# EAGLE design Hirose64-PlatingInterface (EAGLE 9.6.2)
DESIGNER: JON NEWMAN, JAKOB VOIGTS; DESIGN_NAME: HEADSTAGE-64; LICENSE: CERN OHL v1.2; REVISION: 1.2
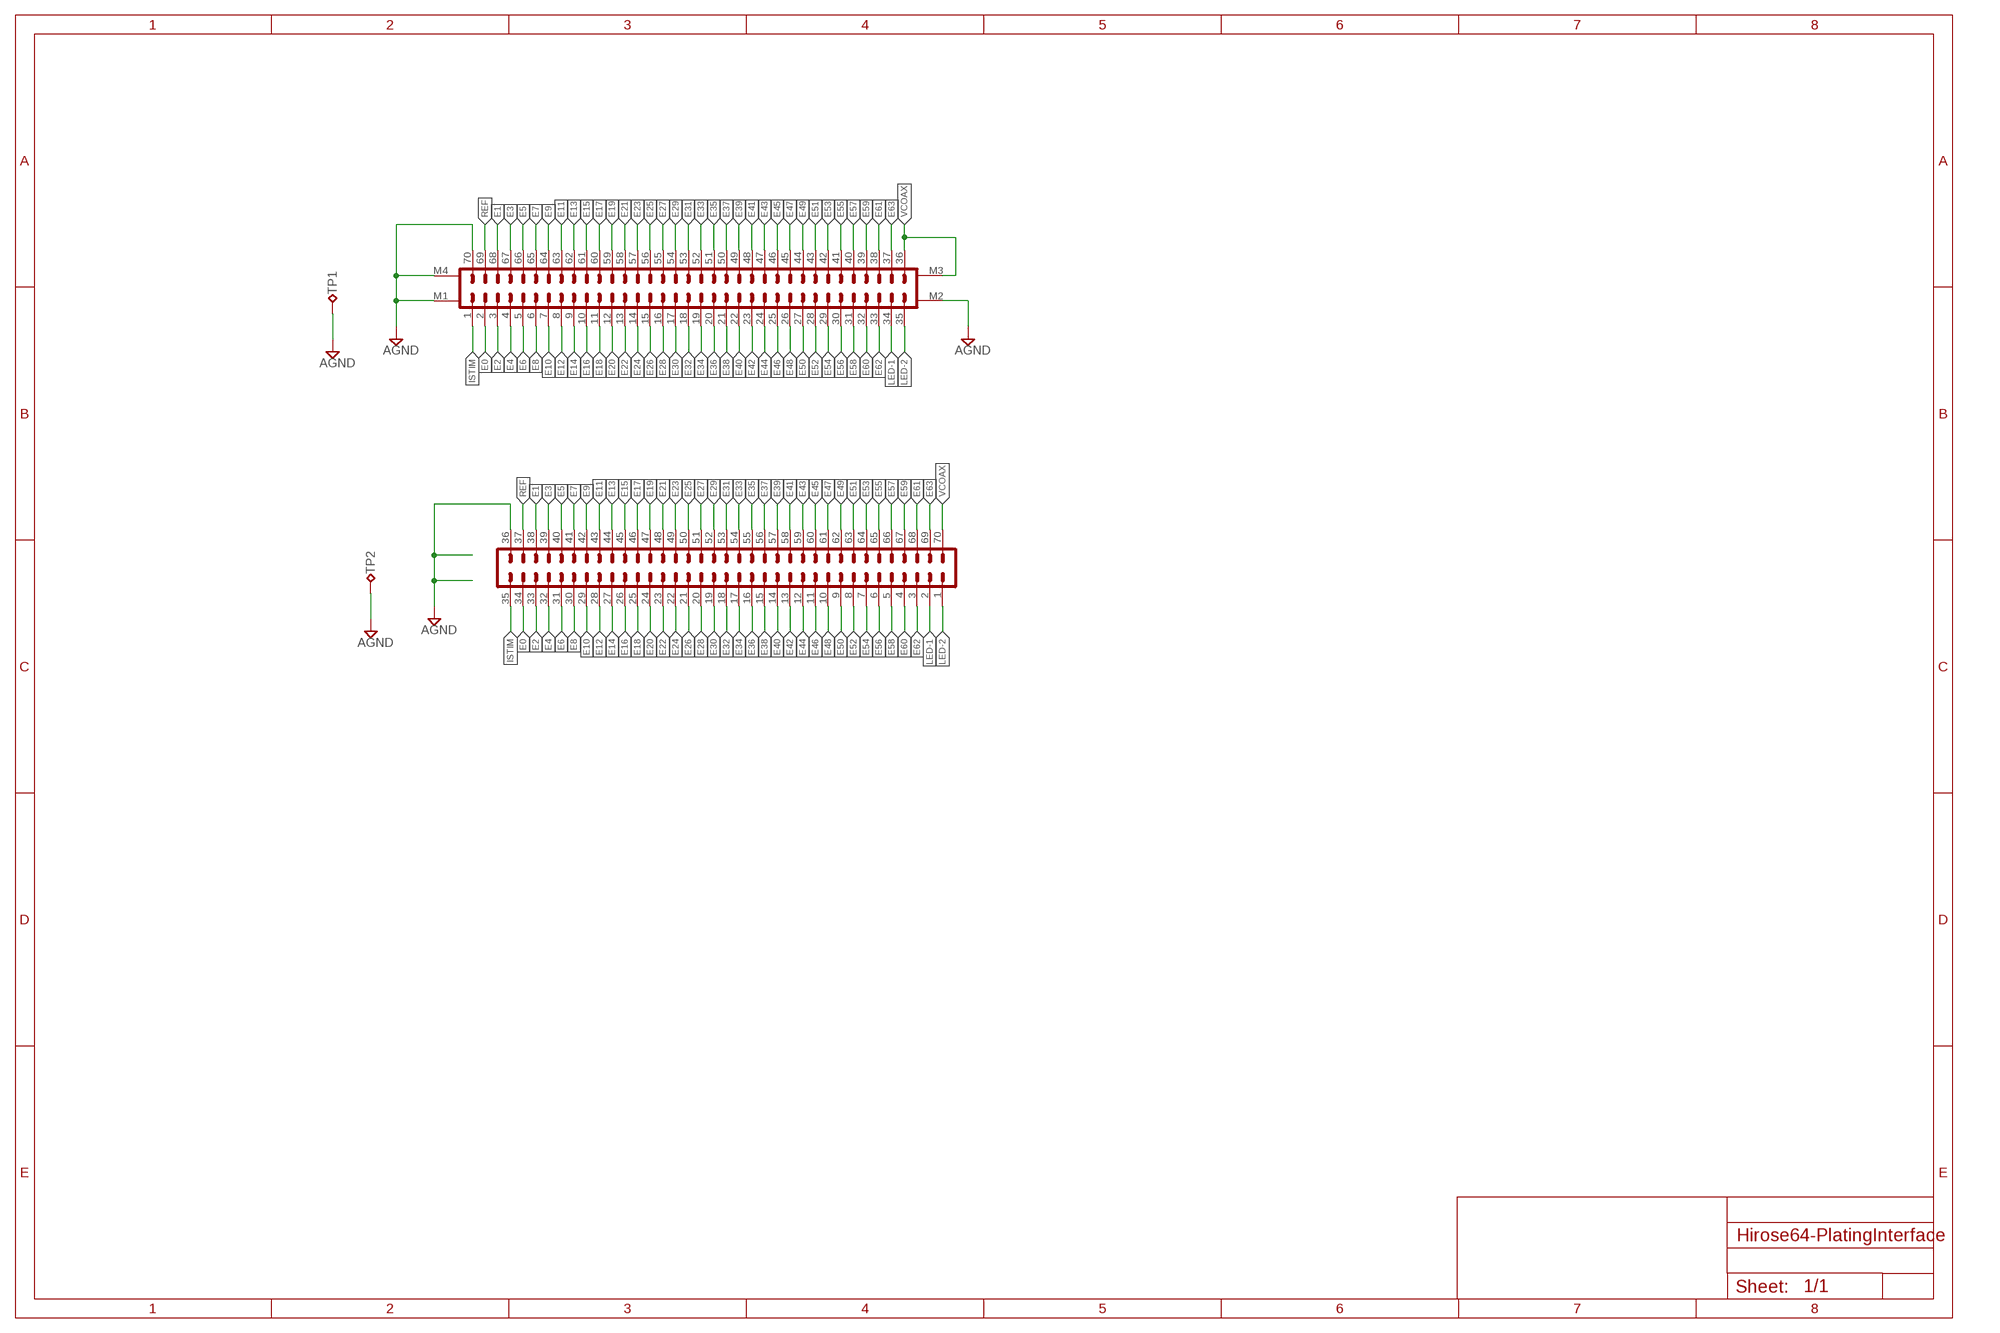
[diagram p0: schematic, sheet 1]

## Parts
J1  DF40C-70DP-0.4V(51)  PINHD-2X35+4DF40-70HEAD-LESS-SILK  [DF40-70HEAD-LESS-SILK]
J3  DF40-REC  PINHD-2X35_DF40REF-LRG  [DDF40-70REC-LRG]
TP1  VCC  TPTP07R  [TP07R]
TP2  VCC  TPTP07R  [TP07R]

## Nets
AGND: J1.70 J1.M1 J1.M2 J1.M4 J3.36 TP1.TP TP2.TP
E0: J1.2 J3.34
E1: J1.68 J3.38
E2: J1.3 J3.33
E3: J1.67 J3.39
E4: J1.4 J3.32
E5: J1.66 J3.40
E6: J1.5 J3.31
E7: J1.65 J3.41
E8: J1.6 J3.30
E9: J1.64 J3.42
E10: J1.7 J3.29
E11: J1.63 J3.43
E12: J1.8 J3.28
E13: J1.62 J3.44
E14: J1.9 J3.27
E15: J1.61 J3.45
E16: J1.10 J3.26
E17: J1.60 J3.46
E18: J1.11 J3.25
E19: J1.59 J3.47
E20: J1.12 J3.24
E21: J1.58 J3.48
E22: J1.13 J3.23
E23: J1.57 J3.49
E24: J1.14 J3.22
E25: J1.56 J3.50
E26: J1.15 J3.21
E27: J1.55 J3.51
E28: J1.16 J3.20
E29: J1.54 J3.52
E30: J1.17 J3.19
E31: J1.53 J3.53
E32: J1.18 J3.18
E33: J1.52 J3.54
E34: J1.19 J3.17
E35: J1.51 J3.55
E36: J1.20 J3.16
E37: J1.50 J3.56
E38: J1.21 J3.15
E39: J1.49 J3.57
E40: J1.22 J3.14
E41: J1.48 J3.58
E42: J1.23 J3.13
E43: J1.47 J3.59
E44: J1.24 J3.12
E45: J1.46 J3.60
E46: J1.25 J3.11
E47: J1.45 J3.61
E48: J1.26 J3.10
E49: J1.44 J3.62
E50: J1.27 J3.9
E51: J1.43 J3.63
E52: J1.28 J3.8
E53: J1.42 J3.64
E54: J1.29 J3.7
E55: J1.41 J3.65
E56: J1.30 J3.6
E57: J1.40 J3.66
E58: J1.31 J3.5
E59: J1.39 J3.67
E60: J1.32 J3.4
E61: J1.38 J3.68
E62: J1.33 J3.3
E63: J1.37 J3.69
ISTIM: J1.1 J3.35
LED-1: J1.34 J3.2
LED-2: J1.35 J3.1
REF: J1.69 J3.37
VCOAX: J1.36 J1.M3 J3.70

## Library data of the parts
J1 = jonnew:PINHD-2X35+4
J3 = jonnew:PINHD-2X35
TP1 TP2 = jonnew:TP: Test pad

## Net classes
1 thick: width 0.102 mm
2 diff: width 0.076 mm, drill 0.1 mm, clearance 0.051 mm

## Board
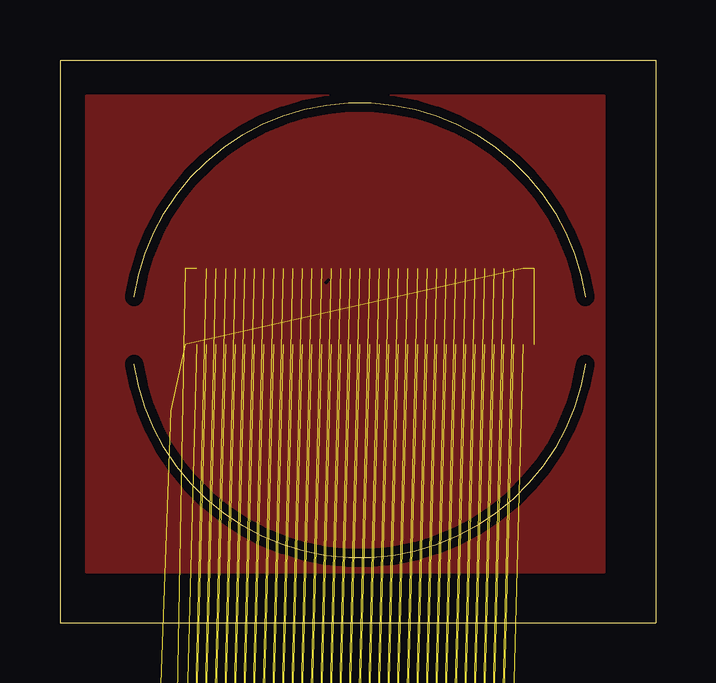
[diagram p1: board, top side]
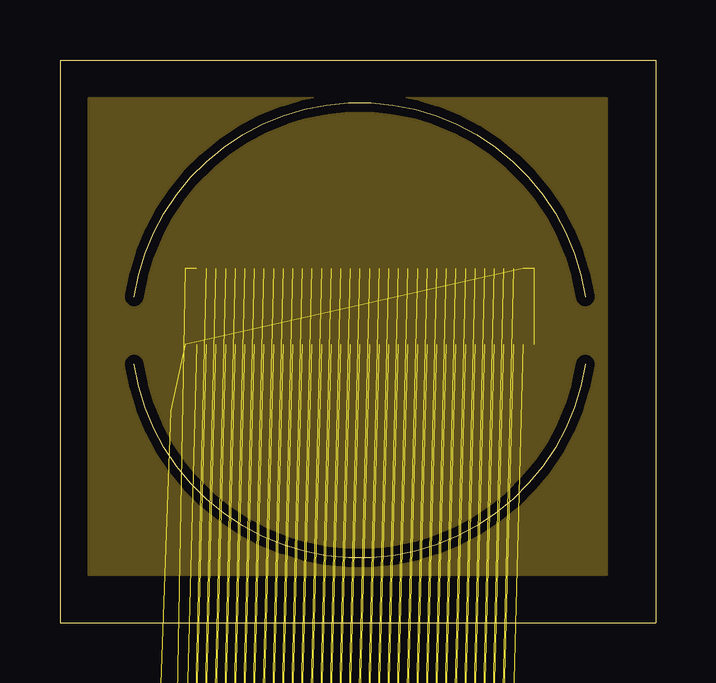
[diagram p2: board, inner layer PWR]
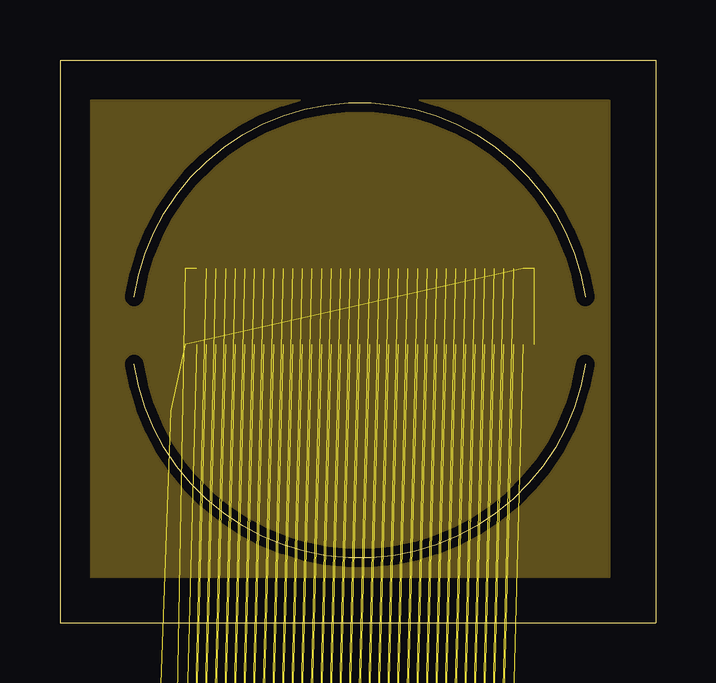
[diagram p3: board, inner layer GND]
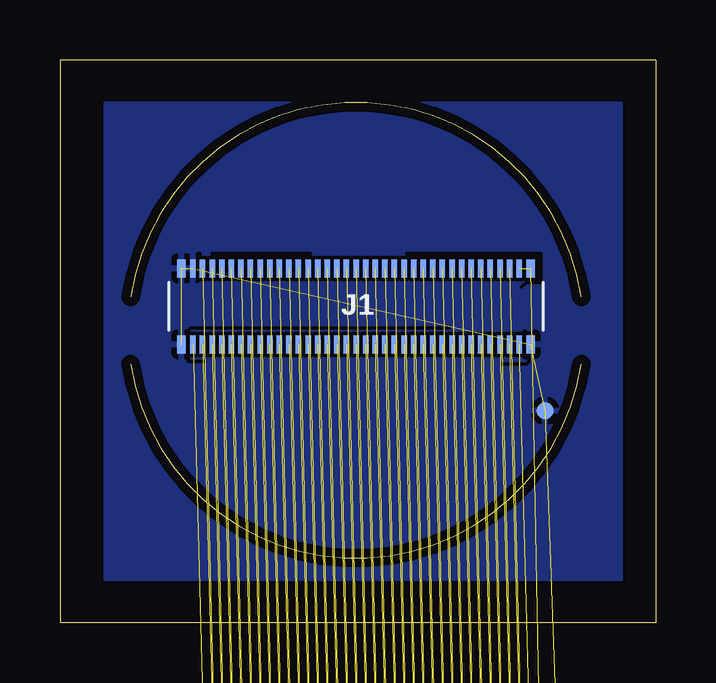
[diagram p4: board, bottom side, seen from below]

Size 24.84 x 23.47 mm. Coordinates in mm from the lower left corner, seen from the top.
Outline: 3.1,13.59 arc-163 21.9,13.59
Outline: 21.9,10.79 arc-163 3.1,10.79
Outline: 0,23.47 24.84,23.47 24.84,0 0,0 0,23.47
Copper layers (1*16): Top 0.035559375mm / dielectric 1.6mm / Bottom 0.035559375mm
Design rules "oshpark-2layer": minimum track width 6mil, minimum drill 10mil, track to track 6mil, track to pad 6mil, pad to pad 6mil, via to via 6mil, smd to smd 6mil, copper to edge 15mil, drill to drill 6mil, minimum pad ring 5mil, minimum via ring 5mil, stop-mask expansion 2.5mil, vias tented up to drill 0mil, thermal gap 10mil
tRestrict: 1 lines
bRestrict: 17 lines

### Footprints (pad centres in the part's own frame; a part is rotated, then mirrored left to right if it is on the bottom)
DF40-70HEAD-LESS-SILK = smd 0.23 x 0.75: 1 -6.8,-1.585; 2 -6.4,-1.585; 3 -6,-1.585; 4 -5.6,-1.585; 5 -5.2,-1.585; 6 -4.8,-1.585; 7 -4.4,-1.585; 8 -4,-1.585; 9 -3.6,-1.585; 10 -3.2,-1.585; 11 -2.8,-1.585; 12 -2.4,-1.585; 13 -2,-1.585; 14 -1.6,-1.585; 15 -1.2,-1.585; 16 -0.8,-1.585; 17 -0.4,-1.585; 18 0,-1.585; 19 0.4,-1.585; 20 0.8,-1.585; 21 1.2,-1.585; 22 1.6,-1.585; 23 2,-1.585; 24 2.4,-1.585; 25 2.8,-1.585; 26 3.2,-1.585; 27 3.6,-1.585; 28 4,-1.585; 29 4.4,-1.585; 30 4.8,-1.585; 31 5.2,-1.585; 32 5.6,-1.585; 33 6,-1.585; 34 6.4,-1.585; 35 6.8,-1.585; 36 6.8,1.585; 37 6.4,1.585; 38 6,1.585; 39 5.6,1.585; 40 5.2,1.585; 41 4.8,1.585; 42 4.4,1.585; 43 4,1.585; 44 3.6,1.585; 45 3.2,1.585; 46 2.8,1.585; 47 2.4,1.585; 48 2,1.585; 49 1.6,1.585; 50 1.2,1.585; 51 0.8,1.585; 52 0.4,1.585; 53 0,1.585; 54 -0.4,1.585; 55 -0.8,1.585; 56 -1.2,1.585; 57 -1.6,1.585; 58 -2,1.585; 59 -2.4,1.585; 60 -2.8,1.585; 61 -3.2,1.585; 62 -3.6,1.585; 63 -4,1.585; 64 -4.4,1.585; 65 -4.8,1.585; 66 -5.2,1.585; 67 -5.6,1.585; 68 -6,1.585; 69 -6.4,1.585; 70 -6.8,1.585 | smd 0.35 x 0.75: M1 -7.275,-1.585; M2 7.275,-1.585; M3 7.275,1.585; M4 -7.275,1.585
DDF40-70REC-LRG = smd 0.2 x 1.64: 1 -6.8,1.42; 2 -6.4,1.42; 3 -6,1.42; 4 -5.6,1.42; 5 -5.2,1.42; 6 -4.8,1.42; 7 -4.4,1.42; 8 -4,1.42; 9 -3.6,1.42; 10 -3.2,1.42; 11 -2.8,1.42; 12 -2.4,1.42; 13 -2,1.42; 14 -1.6,1.42; 15 -1.2,1.42; 16 -0.8,1.42; 17 -0.4,1.42; 18 0,1.42; 19 0.4,1.42; 20 0.8,1.42; 21 1.2,1.42; 22 1.6,1.42; 23 2,1.42; 24 2.4,1.42; 25 2.8,1.42; 26 3.2,1.42; 27 3.6,1.42; 28 4,1.42; 29 4.4,1.42; 30 4.8,1.42; 31 5.2,1.42; 32 5.6,1.42; 33 6,1.42; 34 6.4,1.42; 35 6.8,1.42; 36 6.8,-1.42; 37 6.4,-1.42; 38 6,-1.42; 39 5.6,-1.42; 40 5.2,-1.42; 41 4.8,-1.42; 42 4.4,-1.42; 43 4,-1.42; 44 3.6,-1.42; 45 3.2,-1.42; 46 2.8,-1.42; 47 2.4,-1.42; 48 2,-1.42; 49 1.6,-1.42; 50 1.2,-1.42; 51 0.8,-1.42; 52 0.4,-1.42; 53 0,-1.42; 54 -0.4,-1.42; 55 -0.8,-1.42; 56 -1.2,-1.42; 57 -1.6,-1.42; 58 -2,-1.42; 59 -2.4,-1.42; 60 -2.8,-1.42; 61 -3.2,-1.42; 62 -3.6,-1.42; 63 -4,-1.42; 64 -4.4,-1.42; 65 -4.8,-1.42; 66 -5.2,-1.42; 67 -5.6,-1.42; 68 -6,-1.42; 69 -6.4,-1.42; 70 -6.8,-1.42
TP07R = smd 0.7 x 0.7: TP 0,0

### Placement (x,y rotation side)
J1  12.5,13.19 0 bottom
J3  10.52,-63.86 0 top  (outside the outline)
TP1  4.62,8.84 0 bottom
TP2  2.13,-58.98 0 top  (outside the outline)

### Tracks (layer width: path | path; a pad name or v marks a point on that pad's centre or on a via)
AGND  (6 unrouted)
  pour Top (isolate 0.05, rank 3): 1.1,21.99 22.7,21.99 22.7,2.09 1.1,2.09
  pour GND (isolate 0.05, rank 3, no thermals): 1.3,21.79 22.9,21.79 22.9,1.89 1.3,1.89
  pour Bottom (isolate 0.05, rank 3): 1.4,21.69 23,21.69 23,1.79 1.4,1.79
  pour PWR (isolate 0.05, rank 3, no thermals): 1.2,21.89 22.8,21.89 22.8,1.99 1.2,1.99
E0  (1 unrouted)
E1  (1 unrouted)
E2  (1 unrouted)
E3  (1 unrouted)
E4  (1 unrouted)
E5  (1 unrouted)
E6  (1 unrouted)
E7  (1 unrouted)
E8  (1 unrouted)
E9  (1 unrouted)
E10  (1 unrouted)
E11  (1 unrouted)
E12  (1 unrouted)
E13  (1 unrouted)
E14  (1 unrouted)
E15  (1 unrouted)
E16  (1 unrouted)
E17  (1 unrouted)
E18  (1 unrouted)
E19  (1 unrouted)
E20  (1 unrouted)
E21  (1 unrouted)
E22  (1 unrouted)
E23  (1 unrouted)
E24  (1 unrouted)
E25  (1 unrouted)
E26  (1 unrouted)
E27  (1 unrouted)
E28  (1 unrouted)
E29  (1 unrouted)
E30  (1 unrouted)
E31  (1 unrouted)
E32  (1 unrouted)
E33  (1 unrouted)
E34  (1 unrouted)
E35  (1 unrouted)
E36  (1 unrouted)
E37  (1 unrouted)
E38  (1 unrouted)
E39  (1 unrouted)
E40  (1 unrouted)
E41  (1 unrouted)
E42  (1 unrouted)
E43  (1 unrouted)
E44  (1 unrouted)
E45  (1 unrouted)
E46  (1 unrouted)
E47  (1 unrouted)
E48  (1 unrouted)
E49  (1 unrouted)
E50  (1 unrouted)
E51  (1 unrouted)
E52  (1 unrouted)
E53  (1 unrouted)
E54  (1 unrouted)
E55  (1 unrouted)
E56  (1 unrouted)
E57  (1 unrouted)
E58  (1 unrouted)
E59  (1 unrouted)
E60  (1 unrouted)
E61  (1 unrouted)
E62  (1 unrouted)
E63  (1 unrouted)
ISTIM  (1 unrouted)
LED-1  (1 unrouted)
LED-2  (1 unrouted)
REF  (1 unrouted)
VCOAX  (2 unrouted)